# EAGLE design IO-Board-2 (EAGLE 7.4.0)

## Sheet 1 of 2: Verbinder
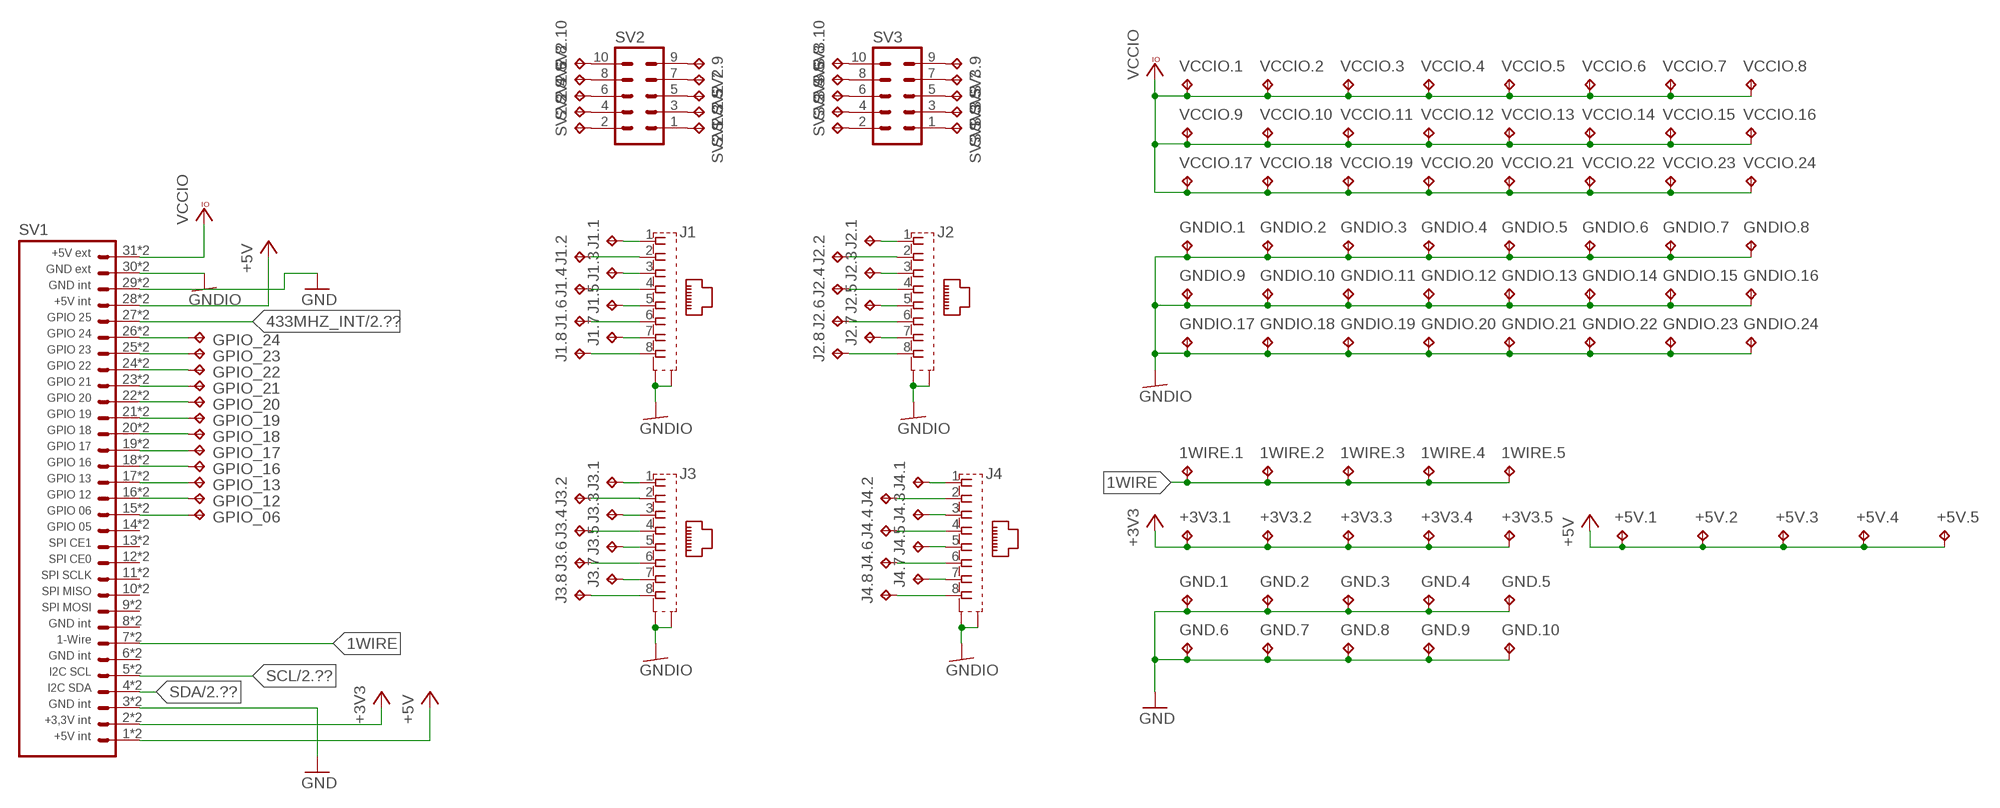
[diagram p0: schematic, sheet 1]

### Parts
1WIRE.1  TPPAD1-13  [P1-13]
1WIRE.2  TPPAD1-13  [P1-13]
1WIRE.3  TPPAD1-13  [P1-13]
1WIRE.4  TPPAD1-13  [P1-13]
1WIRE.5  TPPAD1-13  [P1-13]
+3V3.1  TPPAD1-13  [P1-13]
+3V3.2  TPPAD1-13  [P1-13]
+3V3.3  TPPAD1-13  [P1-13]
+3V3.4  TPPAD1-13  [P1-13]
+3V3.5  TPPAD1-13  [P1-13]
+5V.1  TPPAD1-13  [P1-13]
+5V.2  TPPAD1-13  [P1-13]
+5V.3  TPPAD1-13  [P1-13]
+5V.4  TPPAD1-13  [P1-13]
+5V.5  TPPAD1-13  [P1-13]
GND.1  TPPAD1-13  [P1-13]
GND.2  TPPAD1-13  [P1-13]
GND.3  TPPAD1-13  [P1-13]
GND.4  TPPAD1-13  [P1-13]
GND.5  TPPAD1-13  [P1-13]
GND.6  TPPAD1-13  [P1-13]
GND.7  TPPAD1-13  [P1-13]
GND.8  TPPAD1-13  [P1-13]
GND.9  TPPAD1-13  [P1-13]
GND.10  TPPAD1-13  [P1-13]
GNDIO.1  TPPAD1-13  [P1-13]
GNDIO.2  TPPAD1-13  [P1-13]
GNDIO.3  TPPAD1-13  [P1-13]
GNDIO.4  TPPAD1-13  [P1-13]
GNDIO.5  TPPAD1-13  [P1-13]
GNDIO.6  TPPAD1-13  [P1-13]
GNDIO.7  TPPAD1-13  [P1-13]
GNDIO.8  TPPAD1-13  [P1-13]
GNDIO.9  TPPAD1-13  [P1-13]
GNDIO.10  TPPAD1-13  [P1-13]
GNDIO.11  TPPAD1-13  [P1-13]
GNDIO.12  TPPAD1-13  [P1-13]
GNDIO.13  TPPAD1-13  [P1-13]
GNDIO.14  TPPAD1-13  [P1-13]
GNDIO.15  TPPAD1-13  [P1-13]
GNDIO.16  TPPAD1-13  [P1-13]
GNDIO.17  TPPAD1-13  [P1-13]
GNDIO.18  TPPAD1-13  [P1-13]
GNDIO.19  TPPAD1-13  [P1-13]
GNDIO.20  TPPAD1-13  [P1-13]
GNDIO.21  TPPAD1-13  [P1-13]
GNDIO.22  TPPAD1-13  [P1-13]
GNDIO.23  TPPAD1-13  [P1-13]
GNDIO.24  TPPAD1-13  [P1-13]
GPIO_06  TPPAD1-13  [P1-13]
GPIO_12  TPPAD1-13  [P1-13]
GPIO_13  TPPAD1-13  [P1-13]
GPIO_16  TPPAD1-13  [P1-13]
GPIO_17  TPPAD1-13  [P1-13]
GPIO_18  TPPAD1-13  [P1-13]
GPIO_19  TPPAD1-13  [P1-13]
GPIO_20  TPPAD1-13  [P1-13]
GPIO_21  TPPAD1-13  [P1-13]
GPIO_22  TPPAD1-13  [P1-13]
GPIO_23  TPPAD1-13  [P1-13]
GPIO_24  TPPAD1-13  [P1-13]
J1  555141-1  [555153-1]
J1.1  TPPAD1-13  [P1-13]
J1.2  TPPAD1-13  [P1-13]
J1.3  TPPAD1-13  [P1-13]
J1.4  TPPAD1-13  [P1-13]
J1.5  TPPAD1-13  [P1-13]
J1.6  TPPAD1-13  [P1-13]
J1.7  TPPAD1-13  [P1-13]
J1.8  TPPAD1-13  [P1-13]
J2  555141-1  [555153-1]
J2.1  TPPAD1-13  [P1-13]
J2.2  TPPAD1-13  [P1-13]
J2.3  TPPAD1-13  [P1-13]
J2.4  TPPAD1-13  [P1-13]
J2.5  TPPAD1-13  [P1-13]
J2.6  TPPAD1-13  [P1-13]
J2.7  TPPAD1-13  [P1-13]
J2.8  TPPAD1-13  [P1-13]
J3  555141-1  [555153-1]
J3.1  TPPAD1-13  [P1-13]
J3.2  TPPAD1-13  [P1-13]
J3.3  TPPAD1-13  [P1-13]
J3.4  TPPAD1-13  [P1-13]
J3.5  TPPAD1-13  [P1-13]
J3.6  TPPAD1-13  [P1-13]
J3.7  TPPAD1-13  [P1-13]
J3.8  TPPAD1-13  [P1-13]
J4  555141-1  [555153-1]
J4.1  TPPAD1-13  [P1-13]
J4.2  TPPAD1-13  [P1-13]
J4.3  TPPAD1-13  [P1-13]
J4.4  TPPAD1-13  [P1-13]
J4.5  TPPAD1-13  [P1-13]
J4.6  TPPAD1-13  [P1-13]
J4.7  TPPAD1-13  [P1-13]
J4.8  TPPAD1-13  [P1-13]
SV1  PLATINENVERBINDER-31SMD  [PLATINENVERBINDER-31-SMD]
SV2  ML10  [ML10]
SV2.1  TPPAD1-13  [P1-13]
SV2.2  TPPAD1-13  [P1-13]
SV2.3  TPPAD1-13  [P1-13]
SV2.4  TPPAD1-13  [P1-13]
SV2.5  TPPAD1-13  [P1-13]
SV2.6  TPPAD1-13  [P1-13]
SV2.7  TPPAD1-13  [P1-13]
SV2.8  TPPAD1-13  [P1-13]
SV2.9  TPPAD1-13  [P1-13]
SV2.10  TPPAD1-13  [P1-13]
SV3  ML10  [ML10]
SV3.1  TPPAD1-13  [P1-13]
SV3.2  TPPAD1-13  [P1-13]
SV3.3  TPPAD1-13  [P1-13]
SV3.4  TPPAD1-13  [P1-13]
SV3.5  TPPAD1-13  [P1-13]
SV3.6  TPPAD1-13  [P1-13]
SV3.7  TPPAD1-13  [P1-13]
SV3.8  TPPAD1-13  [P1-13]
SV3.9  TPPAD1-13  [P1-13]
SV3.10  TPPAD1-13  [P1-13]
VCCIO.1  TPPAD1-13  [P1-13]
VCCIO.2  TPPAD1-13  [P1-13]
VCCIO.3  TPPAD1-13  [P1-13]
VCCIO.4  TPPAD1-13  [P1-13]
VCCIO.5  TPPAD1-13  [P1-13]
VCCIO.6  TPPAD1-13  [P1-13]
VCCIO.7  TPPAD1-13  [P1-13]
VCCIO.8  TPPAD1-13  [P1-13]
VCCIO.9  TPPAD1-13  [P1-13]
VCCIO.10  TPPAD1-13  [P1-13]
VCCIO.11  TPPAD1-13  [P1-13]
VCCIO.12  TPPAD1-13  [P1-13]
VCCIO.13  TPPAD1-13  [P1-13]
VCCIO.14  TPPAD1-13  [P1-13]
VCCIO.15  TPPAD1-13  [P1-13]
VCCIO.16  TPPAD1-13  [P1-13]
VCCIO.17  TPPAD1-13  [P1-13]
VCCIO.18  TPPAD1-13  [P1-13]
VCCIO.19  TPPAD1-13  [P1-13]
VCCIO.20  TPPAD1-13  [P1-13]
VCCIO.21  TPPAD1-13  [P1-13]
VCCIO.22  TPPAD1-13  [P1-13]
VCCIO.23  TPPAD1-13  [P1-13]
VCCIO.24  TPPAD1-13  [P1-13]

### Nets
1WIRE: 1WIRE.1.TP 1WIRE.2.TP 1WIRE.3.TP 1WIRE.4.TP 1WIRE.5.TP SV1.7 SV1.7T
433MHZ_INT: SV1.27 SV1.27T ; also sheet 2
+3V3: +3V3.1.TP +3V3.2.TP +3V3.3.TP +3V3.4.TP +3V3.5.TP SV1.2 SV1.2T ; also sheet 2
+5V: +5V.1.TP +5V.2.TP +5V.3.TP +5V.4.TP +5V.5.TP SV1.1 SV1.1T
+5V_2: SV1.28 SV1.28T ; supply symbol labelled +5V ; also sheet 2
GND: GND.1.TP GND.2.TP GND.3.TP GND.4.TP GND.5.TP GND.6.TP GND.7.TP GND.8.TP GND.9.TP GND.10.TP SV1.3 SV1.3T ; also sheet 2
GND_2: SV1.29 SV1.29T ; supply symbol labelled GND ; also sheet 2
GNDIO: GNDIO.1.TP GNDIO.2.TP GNDIO.3.TP GNDIO.4.TP GNDIO.5.TP GNDIO.6.TP GNDIO.7.TP GNDIO.8.TP GNDIO.9.TP GNDIO.10.TP GNDIO.11.TP GNDIO.12.TP GNDIO.13.TP GNDIO.14.TP GNDIO.15.TP GNDIO.16.TP GNDIO.17.TP GNDIO.18.TP GNDIO.19.TP GNDIO.20.TP GNDIO.21.TP GNDIO.22.TP GNDIO.23.TP GNDIO.24.TP J1.G1(S1) J1.G2(S2) J2.G1(S1) J2.G2(S2) J3.G1(S1) J3.G2(S2) J4.G1(S1) J4.G2(S2) SV1.30 SV1.30T
N$1: J4.4 J4.4.TP
N$3: J4.3 J4.3.TP
N$4: J4.2 J4.2.TP
N$5: J4.1 J4.1.TP
N$7: GPIO_24.TP SV1.26 SV1.26T
N$36: J1.1 J1.1.TP
N$37: J1.2 J1.2.TP
N$38: J1.3 J1.3.TP
N$39: J1.4 J1.4.TP
N$40: J1.5 J1.5.TP
N$41: J1.6 J1.6.TP
N$42: J1.7 J1.7.TP
N$43: J1.8 J1.8.TP
N$44: J2.1 J2.1.TP
N$45: J2.2 J2.2.TP
N$46: J2.3 J2.3.TP
N$47: J2.4 J2.4.TP
N$48: J2.5 J2.5.TP
N$49: J2.6 J2.6.TP
N$50: J2.7 J2.7.TP
N$51: J2.8 J2.8.TP
N$129: J3.1 J3.1.TP
N$130: J3.2 J3.2.TP
N$131: J3.3 J3.3.TP
N$132: J3.4 J3.4.TP
N$133: J3.5 J3.5.TP
N$134: J3.6 J3.6.TP
N$135: J3.7 J3.7.TP
N$136: J3.8 J3.8.TP
N$141: J4.5 J4.5.TP
N$142: J4.6 J4.6.TP
N$143: J4.7 J4.7.TP
N$144: J4.8 J4.8.TP
N$146: GPIO_23.TP SV1.25 SV1.25T
N$147: GPIO_22.TP SV1.24 SV1.24T
N$148: GPIO_21.TP SV1.23 SV1.23T
N$149: GPIO_20.TP SV1.22 SV1.22T
N$150: GPIO_19.TP SV1.21 SV1.21T
N$151: GPIO_18.TP SV1.20 SV1.20T
N$152: GPIO_17.TP SV1.19 SV1.19T
N$153: GPIO_16.TP SV1.18 SV1.18T
N$154: GPIO_13.TP SV1.17 SV1.17T
N$155: GPIO_12.TP SV1.16 SV1.16T
N$156: GPIO_06.TP SV1.15 SV1.15T
N$157: SV2.1 SV2.1.TP
N$158: SV2.2 SV2.2.TP
N$159: SV2.3 SV2.3.TP
N$160: SV2.4 SV2.4.TP
N$161: SV2.5 SV2.5.TP
N$162: SV2.6 SV2.6.TP
N$163: SV2.7 SV2.7.TP
N$164: SV2.8 SV2.8.TP
N$165: SV2.9 SV2.9.TP
N$166: SV2.10 SV2.10.TP
N$167: SV3.1 SV3.1.TP
N$168: SV3.2 SV3.2.TP
N$169: SV3.3 SV3.3.TP
N$170: SV3.4 SV3.4.TP
N$171: SV3.5 SV3.5.TP
N$172: SV3.6 SV3.6.TP
N$173: SV3.7 SV3.7.TP
N$174: SV3.8 SV3.8.TP
N$175: SV3.9 SV3.9.TP
N$176: SV3.10 SV3.10.TP
SCL: SV1.5 SV1.5T ; also sheet 2
SDA: SV1.4 SV1.4T ; also sheet 2
VCCIO: SV1.31 SV1.31T VCCIO.1.TP VCCIO.2.TP VCCIO.3.TP VCCIO.4.TP VCCIO.5.TP VCCIO.6.TP VCCIO.7.TP VCCIO.8.TP VCCIO.9.TP VCCIO.10.TP VCCIO.11.TP VCCIO.12.TP VCCIO.13.TP VCCIO.14.TP VCCIO.15.TP VCCIO.16.TP VCCIO.17.TP VCCIO.18.TP VCCIO.19.TP VCCIO.20.TP VCCIO.21.TP VCCIO.22.TP VCCIO.23.TP VCCIO.24.TP
Unconnected: SV1.6 SV1.6T SV1.8 SV1.8T SV1.9 SV1.9T SV1.10 SV1.10T SV1.11 SV1.11T SV1.12 SV1.12T SV1.13 SV1.13T SV1.14 SV1.14T

## Sheet 2 of 2: 433MHz Funk
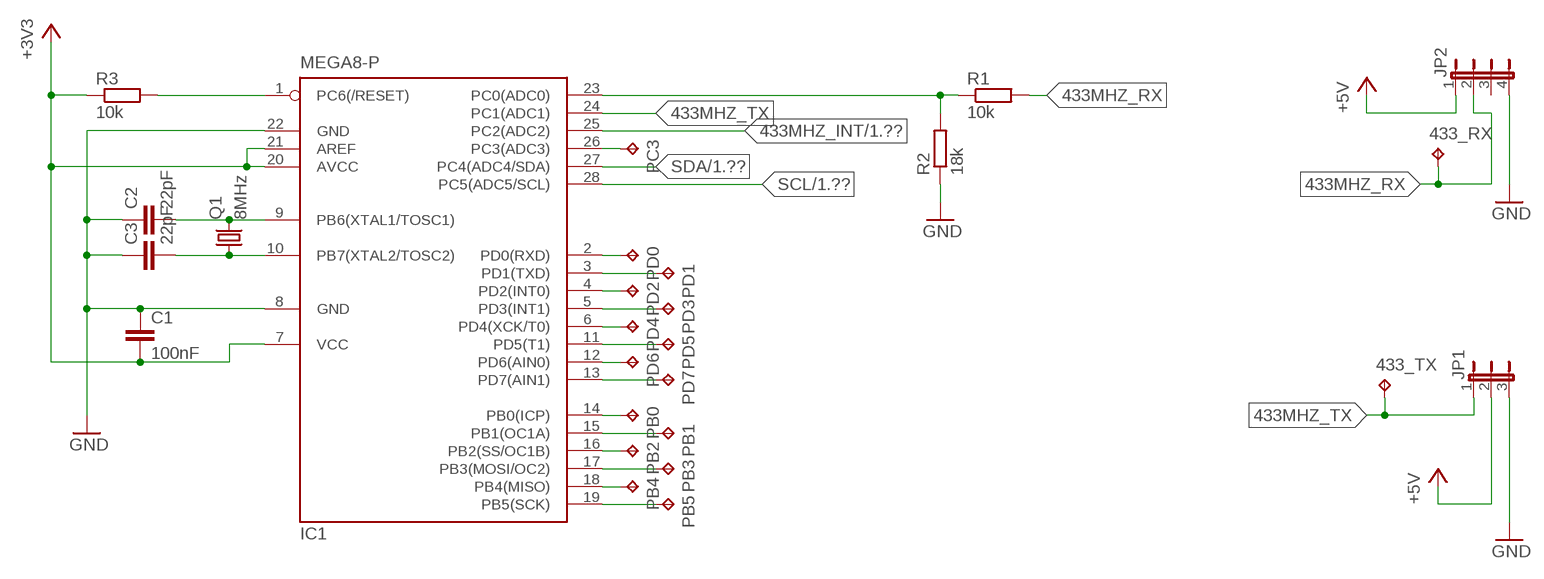
[diagram p1: schematic, sheet 2]

### Parts
433_RX  TPPAD1-13  [P1-13]
433_TX  TPPAD1-13  [P1-13]
C1  100nF  C-EU025-025X050  [C025-025X050]
C2  22pF  C-EU025-025X050  [C025-025X050]
C3  22pF  C-EU025-025X050  [C025-025X050]
IC1  MEGA8-P  [DIL28-3]
JP1  JP2E  [JP2]
JP2  JP4E  [JP4]
PB0  TPPAD1-13  [P1-13]
PB1  TPPAD1-13  [P1-13]
PB2  TPPAD1-13  [P1-13]
PB3  TPPAD1-13  [P1-13]
PB4  TPPAD1-13  [P1-13]
PB5  TPPAD1-13  [P1-13]
PC3  TPPAD1-13  [P1-13]
PD0  TPPAD1-13  [P1-13]
PD1  TPPAD1-13  [P1-13]
PD2  TPPAD1-13  [P1-13]
PD3  TPPAD1-13  [P1-13]
PD4  TPPAD1-13  [P1-13]
PD5  TPPAD1-13  [P1-13]
PD6  TPPAD1-13  [P1-13]
PD7  TPPAD1-13  [P1-13]
Q1  8MHz  CRYSTALHC49U-V  [HC49U-V]
R1  10k  R-EU_0204/5  [0204/5]
R2  18k  R-EU_0204/5  [0204/5]
R3  10k  R-EU_0204/2V  [0204V]

### Nets
433MHZ_INT: IC1.25(PC2(ADC2)) ; also sheet 1
433MHZ_RX: 433_RX.TP JP2.2 R1.2
433MHZ_TX: 433_TX.TP IC1.24(PC1(ADC1)) JP1.1
+3V3: C1.2 IC1.7(VCC) IC1.20(AVCC) IC1.21(AREF) R3.1 ; also sheet 1
+5V_2: JP1.2 JP2.1 ; supply symbol labelled +5V ; also sheet 1
GND: C1.1 C2.1 C3.1 IC1.8(GND) IC1.22(GND) ; also sheet 1
GND_2: JP1.3 JP2.4 R2.1 ; supply symbol labelled GND ; also sheet 1
N$2: IC1.23(PC0(ADC0)) R1.1 R2.2
N$6: IC1.1(PC6(/RESET)) R3.2
N$8: IC1.26(PC3(ADC3)) PC3.TP
N$9: IC1.2(PD0(RXD)) PD0.TP
N$10: IC1.3(PD1(TXD)) PD1.TP
N$11: IC1.4(PD2(INT0)) PD2.TP
N$12: IC1.5(PD3(INT1)) PD3.TP
N$13: IC1.6(PD4(XCK/T0)) PD4.TP
N$14: IC1.11(PD5(T1)) PD5.TP
N$15: IC1.12(PD6(AIN0)) PD6.TP
N$16: IC1.13(PD7(AIN1)) PD7.TP
N$17: IC1.14(PB0(ICP)) PB0.TP
N$18: IC1.15(PB1(OC1A)) PB1.TP
N$19: IC1.16(PB2(SS/OC1B)) PB2.TP
N$20: IC1.17(PB3(MOSI/OC2)) PB3.TP
N$21: IC1.18(PB4(MISO)) PB4.TP
N$22: IC1.19(PB5(SCK)) PB5.TP
N$23: C3.2 IC1.10(PB7(XTAL2/TOSC2)) Q1.1
N$24: C2.2 IC1.9(PB6(XTAL1/TOSC1)) Q1.2
SCL: IC1.28(PC5(ADC5/SCL)) ; also sheet 1
SDA: IC1.27(PC4(ADC4/SDA)) ; also sheet 1
Unconnected: JP2.3

## Library data of the parts
1WIRE.1-1WIRE.5 433_RX 433_TX +3V3.1-+3V3.5 +5V.1-+5V.5 GND.1-GND.10 GNDIO.1-GNDIO.24 GPIO_06 GPIO_12 GPIO_13 GPIO_16-GPIO_24 J1.1-J1.8 J2.1-J2.8 J3.1-J3.8 J4.1-J4.8 PB0 PB1-PB5 PC3 PD0 PD1-PD7 SV2.1-SV2.10 SV3.1-SV3.10 VCCIO.1-VCCIO.24 = testpad:TP: Test pad
C1-C3 = rcl:C-EU: CAPACITOR, European symbol
IC1 = atmel:MEGA8-P: MICROCONTROLLER 8 Kbytes FLASH, 1 kbytes SRAM, 512 bytes EEPROM, USART, 4-channel 10 bit ADC, 2-channel 8 bit ADC Pin compatible with Atmega48, ATMega88, ATMega168 Source: avr.lbr; OC_FARNELL: unknown; OC_NEWARK: unknown
J1-J4 = con-amp:555141-1: AMP connector
JP1 = jumper:JP2E: JUMPER
JP2 = jumper:JP4E: JUMPER
Q1 = crystal:CRYSTAL: CRYSTAL; OC_FARNELL: 1666969; OC_NEWARK: unknown
R1-R3 = rcl:R-EU_: RESISTOR, European symbol
SV1 = homepi:PLATINENVERBINDER-31: 31-poliger Steckverbinder
SV2 SV3 = con-harting-ml:ML10: HARTING; OC_FARNELL: unknown; OC_NEWARK: unknown

## Board
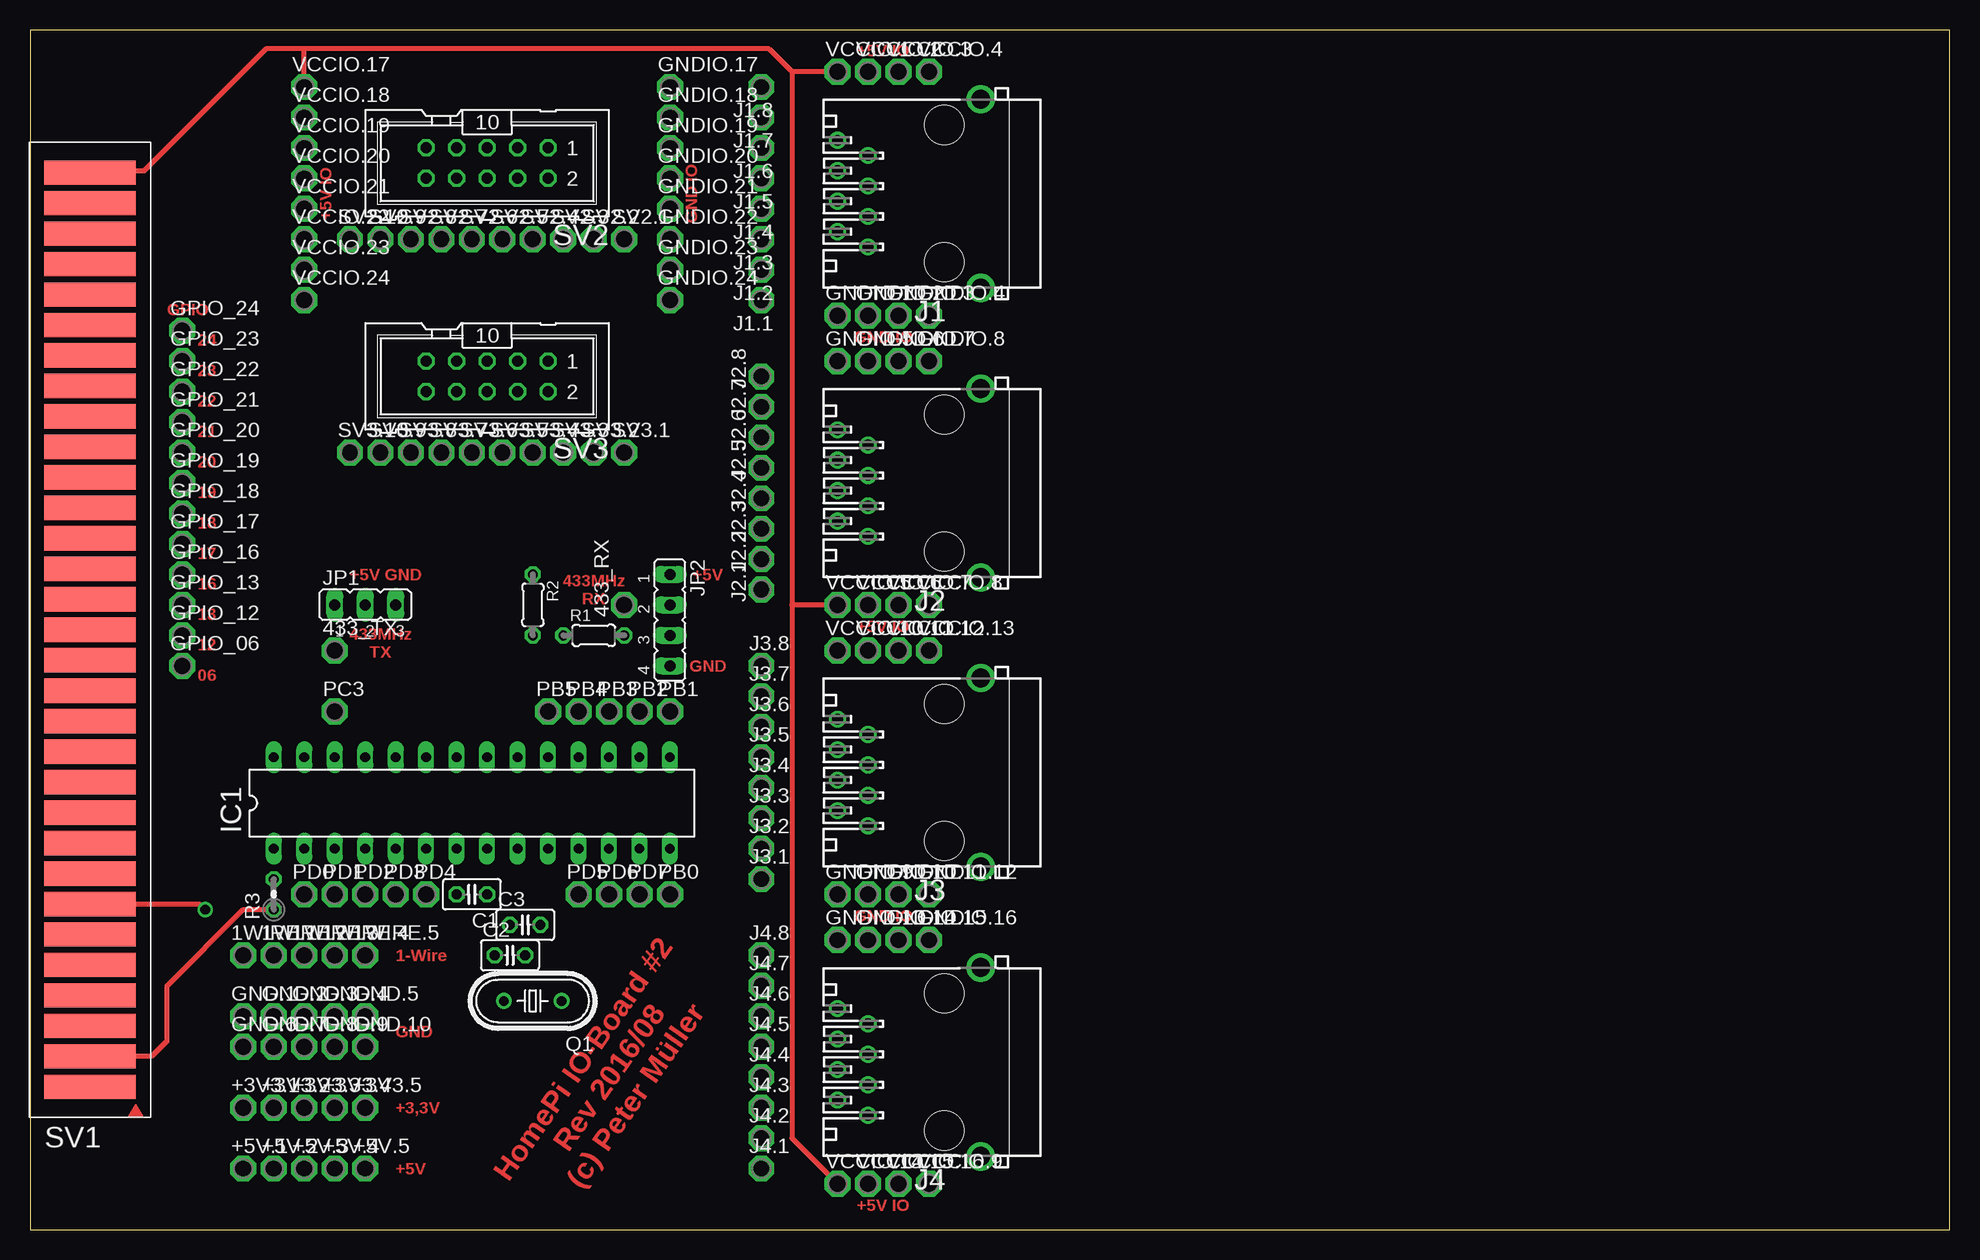
[diagram p2: board, top side]
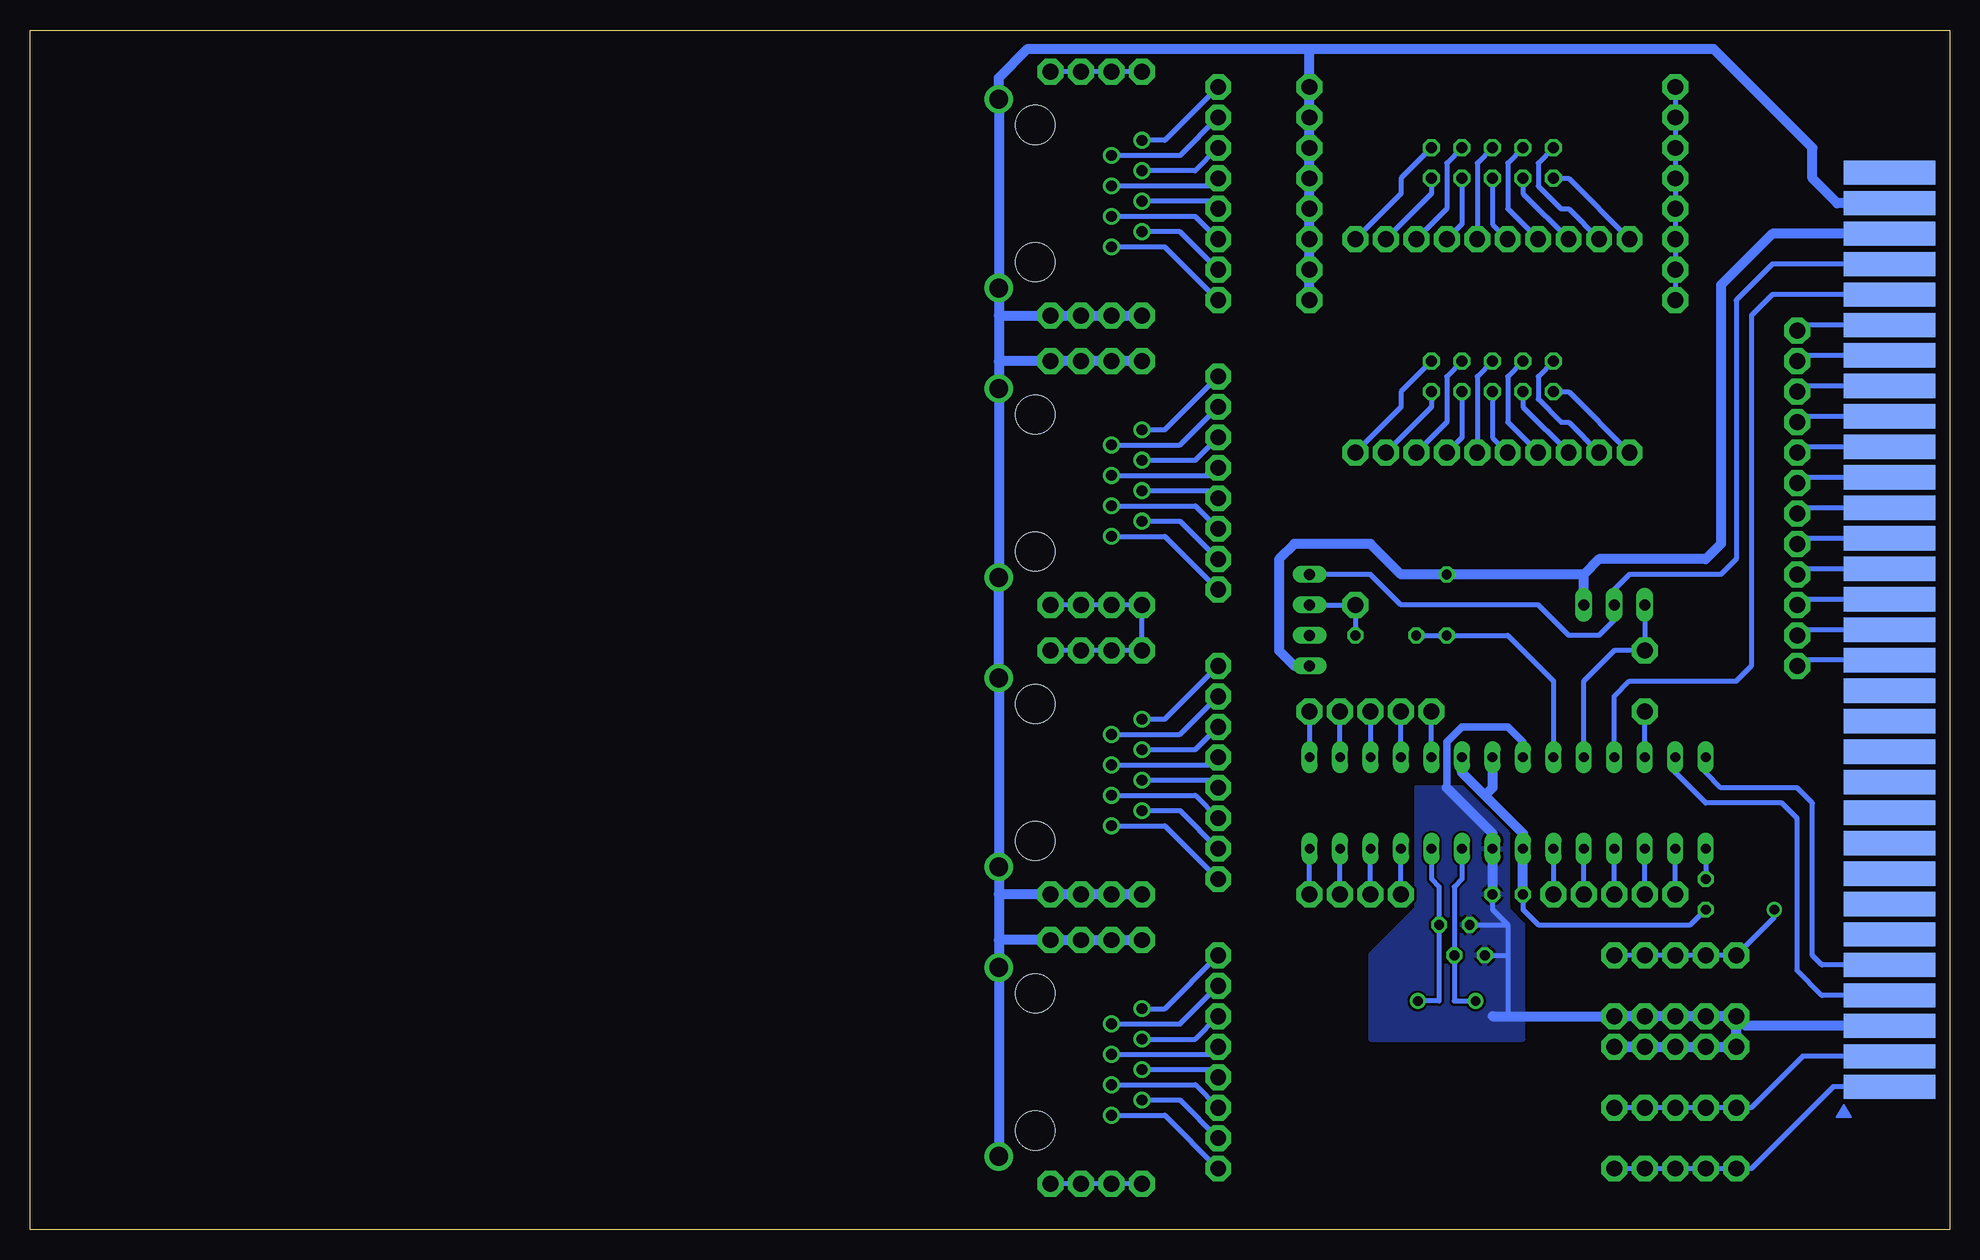
[diagram p3: board, bottom side, seen from below]

Size 160 x 100 mm. Coordinates in mm from the lower left corner, seen from the top.
Outline: 0,0 160,0 160,100 0,100 0,0
Copper layers (1*16): Top 0.035mm / dielectric 1.5mm / Bottom 0.035mm
Design rules "default": minimum track width 10mil, minimum drill 24mil, track to track 8mil, track to pad 8mil, pad to pad 8mil, via to via 8mil, smd to smd 8mil, copper to edge 40mil, drill to drill 8mil, minimum pad ring 10mil, minimum via ring 8mil, stop-mask expansion 4mil, vias tented up to drill 0mil, thermal gap 10mil

### Footprints (pad centres in the part's own frame; a part is rotated, then mirrored left to right if it is on the bottom)
P1-13 = drill 1.321 pad 2.159 octagon: TP 0,0
C025-025X050 = drill 0.813 octagon: 1 -1.27,0; 2 1.27,0
DIL28-3 = drill 0.813 long: 1 -16.51,-3.81; 2 -13.97,-3.81; 3 -11.43,-3.81; 4 -8.89,-3.81; 5 -6.35,-3.81; 6 -3.81,-3.81; 7 -1.27,-3.81; 8 1.27,-3.81; 9 3.81,-3.81; 10 6.35,-3.81; 11 8.89,-3.81; 12 11.43,-3.81; 13 13.97,-3.81; 14 16.51,-3.81; 15 16.51,3.81; 16 13.97,3.81; 17 11.43,3.81; 18 8.89,3.81; 19 6.35,3.81; 20 3.81,3.81; 21 1.27,3.81; 22 -1.27,3.81; 23 -3.81,3.81; 24 -6.35,3.81; 25 -8.89,3.81; 26 -11.43,3.81; 27 -13.97,3.81; 28 -16.51,3.81
555153-1 = drill 0.889: 1 -4.445,6.35; 2 -3.175,8.89; 3 -1.905,6.35; 4 -0.635,8.89; 5 0.635,6.35; 6 1.905,8.89; 7 3.175,6.35; 8 4.445,8.89 | drill 1.575 pad 2.184: G1 -7.874,-3.048; G2 7.874,-3.048 | hole 3.251: -5.715,0; 5.715,0
JP2 = drill 0.914 long: 1 -2.54,0; 2 0,0; 3 2.54,0
JP4 = drill 0.914 long: 1 -3.81,0; 2 -1.27,0; 3 1.27,0; 4 3.81,0
HC49U-V = drill 0.813: 1 -2.413,0; 2 2.413,0
0204/5 = drill 0.813 octagon: 1 -2.54,0; 2 2.54,0
0204V = drill 0.813 octagon: 1 -1.27,0; 2 1.27,0
PLATINENVERBINDER-31-SMD = smd 7.62 x 2.032 bottom: 1 0,-38.1; 2 0,-35.56; 3 0,-33.02; 4 0,-30.48; 5 0,-27.94; 6 0,-25.4; 7 0,-22.86; 8 0,-20.32; 9 0,-17.78; 10 0,-15.24; 11 0,-12.7; 12 0,-10.16; 13 0,-7.62; 14 0,-5.08; 15 0,-2.54; 16 0,0; 17 0,2.54; 18 0,5.08; 19 0,7.62; 20 0,10.16; 21 0,12.7; 22 0,15.24; 23 0,17.78; 24 0,20.32; 25 0,22.86; 26 0,25.4; 27 0,27.94; 28 0,30.48; 29 0,33.02; 30 0,35.56; 31 0,38.1 | smd 7.62 x 2.032: 1T 0,-38.1; 2T 0,-35.56; 3T 0,-33.02; 4T 0,-30.48; 5T 0,-27.94; 6T 0,-25.4; 7T 0,-22.86; 8T 0,-20.32; 9T 0,-17.78; 10T 0,-15.24; 11T 0,-12.7; 12T 0,-10.16; 13T 0,-7.62; 14T 0,-5.08; 15T 0,-2.54; 16T 0,0; 17T 0,2.54; 18T 0,5.08; 19T 0,7.62; 20T 0,10.16; 21T 0,12.7; 22T 0,15.24; 23T 0,17.78; 24T 0,20.32; 25T 0,22.86; 26T 0,25.4; 27T 0,27.94; 28T 0,30.48; 29T 0,33.02; 30T 0,35.56; 31T 0,38.1
ML10 = drill 0.914 octagon: 1 -5.08,-1.27; 2 -5.08,1.27; 3 -2.54,-1.27; 4 -2.54,1.27; 5 0,-1.27; 6 0,1.27; 7 2.54,-1.27; 8 2.54,1.27; 9 5.08,-1.27; 10 5.08,1.27

### Placement (x,y rotation side)
1WIRE.1  17.78,22.86 0 top
1WIRE.2  20.32,22.86 0 top
1WIRE.3  22.86,22.86 0 top
1WIRE.4  25.4,22.86 0 top
1WIRE.5  27.94,22.86 0 top
433_RX  49.53,52.07 90 top
433_TX  25.4,48.26 0 top
+3V3.1  17.78,10.16 0 top
+3V3.2  20.32,10.16 0 top
+3V3.3  22.86,10.16 0 top
+3V3.4  25.4,10.16 0 top
+3V3.5  27.94,10.16 0 top
+5V.1  17.78,5.08 0 top
+5V.2  20.32,5.08 0 top
+5V.3  22.86,5.08 0 top
+5V.4  25.4,5.08 0 top
+5V.5  27.94,5.08 0 top
C1  36.83,27.94 180 top
C2  40.01,22.86 0 top
C3  41.27,25.4 0 top
GND.1  17.78,17.78 0 top
GND.2  20.32,17.78 0 top
GND.3  22.86,17.78 0 top
GND.4  25.4,17.78 0 top
GND.5  27.94,17.78 0 top
GND.6  17.78,15.24 0 top
GND.7  20.32,15.24 0 top
GND.8  22.86,15.24 0 top
GND.9  25.4,15.24 0 top
GND.10  27.94,15.24 0 top
GNDIO.1  67.31,76.2 0 top
GNDIO.2  69.85,76.2 0 top
GNDIO.3  72.39,76.2 0 top
GNDIO.4  74.93,76.2 0 top
GNDIO.5  67.31,72.39 0 top
GNDIO.6  69.85,72.39 0 top
GNDIO.7  72.39,72.39 0 top
GNDIO.8  74.93,72.39 0 top
GNDIO.9  67.31,27.94 0 top
GNDIO.10  69.85,27.94 0 top
GNDIO.11  72.39,27.94 0 top
GNDIO.12  74.93,27.94 0 top
GNDIO.13  67.31,24.13 0 top
GNDIO.14  69.85,24.13 0 top
GNDIO.15  72.39,24.13 0 top
GNDIO.16  74.93,24.13 0 top
GNDIO.17  53.34,95.25 0 top
GNDIO.18  53.34,92.71 0 top
GNDIO.19  53.34,90.17 0 top
GNDIO.20  53.34,87.63 0 top
GNDIO.21  53.34,85.09 0 top
GNDIO.22  53.34,82.55 0 top
GNDIO.23  53.34,80.01 0 top
GNDIO.24  53.34,77.47 0 top
GPIO_06  12.7,46.99 0 top
GPIO_12  12.7,49.53 0 top
GPIO_13  12.7,52.07 0 top
GPIO_16  12.7,54.61 0 top
GPIO_17  12.7,57.15 0 top
GPIO_18  12.7,59.69 0 top
GPIO_19  12.7,62.23 0 top
GPIO_20  12.7,64.77 0 top
GPIO_21  12.7,67.31 0 top
GPIO_22  12.7,69.85 0 top
GPIO_23  12.7,72.39 0 top
GPIO_24  12.7,74.93 0 top
IC1  36.83,35.56 0 top
J1  76.2,86.36 90 top
J1.1  60.96,77.47 180 top
J1.2  60.96,80.01 180 top
J1.3  60.96,82.55 180 top
J1.4  60.96,85.09 180 top
J1.5  60.96,87.63 180 top
J1.6  60.96,90.17 180 top
J1.7  60.96,92.71 180 top
J1.8  60.96,95.25 180 top
J2  76.2,62.23 90 top
J2.1  60.96,53.34 90 top
J2.2  60.96,55.88 90 top
J2.3  60.96,58.42 90 top
J2.4  60.96,60.96 90 top
J2.5  60.96,63.5 90 top
J2.6  60.96,66.04 90 top
J2.7  60.96,68.58 90 top
J2.8  60.96,71.12 90 top
J3  76.2,38.1 90 top
J3.1  60.96,29.21 0 top
J3.2  60.96,31.75 0 top
J3.3  60.96,34.29 0 top
J3.4  60.96,36.83 0 top
J3.5  60.96,39.37 0 top
J3.6  60.96,41.91 0 top
J3.7  60.96,44.45 0 top
J3.8  60.96,46.99 0 top
J4  76.2,13.97 90 top
J4.1  60.96,5.08 0 top
J4.2  60.96,7.62 0 top
J4.3  60.96,10.16 0 top
J4.4  60.96,12.7 0 top
J4.5  60.96,15.24 0 top
J4.6  60.96,17.78 0 top
J4.7  60.96,20.32 0 top
J4.8  60.96,22.86 0 top
JP1  27.94,52.07 0 top
JP2  53.34,50.8 270 top
PB0  53.34,27.94 0 top
PB1  53.34,43.18 0 top
PB2  50.8,43.18 0 top
PB3  48.26,43.18 0 top
PB4  45.72,43.18 0 top
PB5  43.18,43.18 0 top
PC3  25.4,43.18 0 top
PD0  22.86,27.94 0 top
PD1  25.4,27.94 0 top
PD2  27.94,27.94 0 top
PD3  30.48,27.94 0 top
PD4  33.02,27.94 0 top
PD5  45.72,27.94 0 top
PD6  48.26,27.94 0 top
PD7  50.8,27.94 0 top
Q1  41.91,19.05 180 top
R1  46.99,49.53 0 top
R2  41.91,52.07 270 top
R3  20.32,27.94 90 top
SV1  5,50 0 top
SV2  38.1,88.9 180 top
SV2.1  49.53,82.55 0 top
SV2.2  46.99,82.55 0 top
SV2.3  44.45,82.55 0 top
SV2.4  41.91,82.55 0 top
SV2.5  39.37,82.55 0 top
SV2.6  36.83,82.55 0 top
SV2.7  34.29,82.55 0 top
SV2.8  31.75,82.55 0 top
SV2.9  29.21,82.55 0 top
SV2.10  26.67,82.55 0 top
SV3  38.1,71.12 180 top
SV3.1  49.53,64.77 0 top
SV3.2  46.99,64.77 0 top
SV3.3  44.45,64.77 0 top
SV3.4  41.91,64.77 0 top
SV3.5  39.37,64.77 0 top
SV3.6  36.83,64.77 0 top
SV3.7  34.29,64.77 0 top
SV3.8  31.75,64.77 0 top
SV3.9  29.21,64.77 0 top
SV3.10  26.67,64.77 0 top
VCCIO.1  67.31,96.52 0 top
VCCIO.2  69.85,96.52 0 top
VCCIO.3  72.39,96.52 0 top
VCCIO.4  74.93,96.52 0 top
VCCIO.5  67.31,52.07 0 top
VCCIO.6  69.85,52.07 0 top
VCCIO.7  72.39,52.07 0 top
VCCIO.8  74.93,52.07 0 top
VCCIO.9  74.93,3.81 0 top
VCCIO.10  67.31,48.26 0 top
VCCIO.11  69.85,48.26 0 top
VCCIO.12  72.39,48.26 0 top
VCCIO.13  74.93,48.26 0 top
VCCIO.14  67.31,3.81 0 top
VCCIO.15  69.85,3.81 0 top
VCCIO.16  72.39,3.81 0 top
VCCIO.17  22.86,95.25 0 top
VCCIO.18  22.86,92.71 0 top
VCCIO.19  22.86,90.17 0 top
VCCIO.20  22.86,87.63 0 top
VCCIO.21  22.86,85.09 0 top
VCCIO.22  22.86,82.55 0 top
VCCIO.23  22.86,80.01 0 top
VCCIO.24  22.86,77.47 0 top

### Tracks (layer width: path | path; a pad name or v marks a point on that pad's centre or on a via)
1WIRE  (via drill 0.8 pad 1.27)
  Top 0.406: SV1.7T 14.13,27.14 v14.61,26.67
  Bottom 0.406: 1WIRE.5.TP 1WIRE.4.TP 1WIRE.3.TP 1WIRE.2.TP 1WIRE.1.TP 14.61,26.04 v14.61,26.67
433MHZ_INT
  Bottom 0.406: SV1.27 14.77,77.94 16.51,76.2 16.51,46.99 17.78,45.72 26.67,45.72 27.94,44.45 IC1.25
433MHZ_RX
  Bottom 0.406: R1.2 433_RX.TP JP2.2
433MHZ_TX
  Bottom 0.406: JP1.1 433_TX.TP 27.94,48.26 30.48,45.72 IC1.24
+3V3
  Top 0.406: SV1.2T 10.16,14.44 11.43,15.71 11.43,20.32 17.78,26.67 R3.1
  Bottom 0.406: +3V3.5.TP +3V3.4.TP +3V3.3.TP +3V3.2.TP +3V3.1.TP 16.51,10.16 12.23,14.44 SV1.2T | C1.2 35.56,26.67 34.29,25.4 21.59,25.4 R3.1
  Bottom 0.813: C1.2 IC1.7 35.56,33.02 38.73,36.2 | 38.73,36.2 40.64,38.1 IC1.20 | IC1.21 38.1,36.83 38.73,36.2
+5V
  Bottom 0.406: +5V.5.TP +5V.4.TP +5V.3.TP +5V.2.TP +5V.1.TP 16.51,5.08 9.69,11.9 SV1.1
+5V_2
  Bottom 0.406: SV1.28 14.77,80.48 17.78,77.47 17.78,55.88 19.05,54.61 26.67,54.61 27.94,53.34 JP1.2 27.94,50.8 29.21,49.53 31.75,49.53 34.29,52.07 45.72,52.07 48.26,54.61 JP2.1
GND
  Bottom 0.406: C1.1 38.1,26.67 36.83,25.4 | 36.83,25.4 36.83,22.86 | 36.83,22.86 36.83,17.78 | C2.1 36.83,22.86 | C3.1 36.83,25.4
  Bottom 0.61: 41.91,36.83 41.91,40.64 40.64,41.91 36.83,41.91 35.56,40.64 IC1.22
  Bottom 0.813: GND.1.TP GND.2.TP GND.3.TP GND.4.TP GND.5.TP 36.83,17.78 38.1,17.78 | GND.6.TP GND.1.TP | GND.6.TP GND.7.TP GND.8.TP GND.10.TP GND.9.TP | 17.31,15.71 GND.6.TP | C1.1 IC1.8 38.1,33.02 41.91,36.83 | SV1.3T 16.98,16.98 GND.1.TP
  pour Bottom: 35.56,15.88 35.56,25.4 36.83,26.67 36.83,33.02 40.64,36.83 44.45,36.83 44.45,26.67 48.26,22.86 48.26,15.88
GND_2
  Bottom 0.813: SV1.29T 14.77,83.02 19.05,78.74 19.05,57.15 20.32,55.88 29.21,55.88 30.48,54.61 | 30.48,54.61 R2.1 45.72,54.61 48.26,57.15 54.61,57.15 55.88,55.88 55.88,48.26 54.61,46.99 JP2.4 | JP1.3 30.48,54.61
GNDIO
  Bottom 0.813: 79.25,76.2 J1.G1 J1.G2 79.25,96.01 76.83,98.42 53.34,98.42 | 79.25,76.2 79.25,72.39 | 79.25,72.39 J2.G2 J2.G1 J3.G2 J3.G1 79.25,27.94 | 53.34,98.42 19.68,98.42 11.43,90.17 11.43,87.63 9.36,85.56 SV1.30T | 79.25,27.94 79.25,24.13 | 79.25,24.13 J4.G2 J4.G1 79.38,5.97 | 79.25,76.2 GNDIO.4.TP GNDIO.3.TP GNDIO.2.TP GNDIO.1.TP | GNDIO.5.TP GNDIO.6.TP GNDIO.7.TP GNDIO.8.TP 79.25,72.39 | 79.25,27.94 GNDIO.12.TP GNDIO.11.TP GNDIO.10.TP GNDIO.9.TP | 79.25,24.13 GNDIO.16.TP GNDIO.15.TP GNDIO.14.TP GNDIO.13.TP | 53.34,98.42 GNDIO.17.TP GNDIO.18.TP GNDIO.19.TP GNDIO.20.TP GNDIO.21.TP GNDIO.22.TP GNDIO.23.TP GNDIO.24.TP
N$1
  Bottom 0.406: J4.4 61.59,13.34 J4.4.TP
N$2
  Bottom 0.406: IC1.23 33.02,45.72 36.83,49.53 R2.2 R1.1
N$3
  Bottom 0.406: J4.3 62.87,12.06 J4.3.TP
N$4
  Bottom 0.406: J4.2 64.14,10.79 J4.2.TP
N$5
  Bottom 0.406: J4.1 65.41,9.53 J4.1.TP
N$6
  Bottom 0.406: IC1.1 R3.2
N$7
  Bottom 0.406: SV1.26T 12.23,75.4 GPIO_24.TP
N$8
  Bottom 0.406: IC1.26 PC3.TP
N$9
  Bottom 0.406: PD0.TP IC1.2
N$10
  Bottom 0.406: PD1.TP IC1.3
N$11
  Bottom 0.406: PD2.TP IC1.4
N$12
  Bottom 0.406: PD3.TP IC1.5
N$13
  Bottom 0.406: IC1.6 PD4.TP
N$14
  Bottom 0.406: PD5.TP IC1.11
N$15
  Bottom 0.406: PD6.TP IC1.12
N$16
  Bottom 0.406: PD7.TP IC1.13
N$17
  Bottom 0.406: PB0.TP IC1.14
N$18
  Bottom 0.406: PB1.TP IC1.15
N$19
  Bottom 0.406: IC1.16 PB2.TP
N$20
  Bottom 0.406: PB3.TP IC1.17
N$21
  Bottom 0.406: IC1.18 PB4.TP
N$22
  Bottom 0.406: IC1.19 PB5.TP
N$23
  Bottom 0.406: IC1.10 43.18,29.21 42.55,28.57 C3.2 42.55,19.05 Q1.1
N$24
  Bottom 0.406: IC1.9 40.64,29.21 41.27,28.57 C2.2 41.27,19.05 Q1.2
N$36
  Bottom 0.406: J1.1.TP 65.41,81.92 J1.1
N$37
  Bottom 0.406: J1.2.TP 64.14,83.19 J1.2
N$38
  Bottom 0.406: J1.3 62.87,84.45 J1.3.TP
N$39
  Bottom 0.406: J1.4 61.59,85.72 J1.4.TP
N$40
  Bottom 0.406: J1.5 61.59,87 J1.5.TP
N$41
  Bottom 0.406: J1.6 62.87,88.27 J1.6.TP
N$42
  Bottom 0.406: J1.7.TP 64.14,89.53 J1.7
N$43
  Bottom 0.406: J1.8.TP 65.41,90.81 J1.8
N$44
  Bottom 0.406: J2.1 65.41,57.78 J2.1.TP
N$45
  Bottom 0.406: J2.2 64.14,59.05 J2.2.TP
N$46
  Bottom 0.406: J2.3 62.87,60.33 J2.3.TP
N$47
  Bottom 0.406: J2.4 61.59,61.59 J2.4.TP
N$48
  Bottom 0.406: J2.5 61.59,62.87 J2.5.TP
N$49
  Bottom 0.406: J2.6 62.87,64.14 J2.6.TP
N$50
  Bottom 0.406: J2.7 64.14,65.41 J2.7.TP
N$51
  Bottom 0.406: J2.8 65.41,66.67 J2.8.TP
N$129
  Bottom 0.406: J3.1 65.41,33.66 J3.1.TP
N$130
  Bottom 0.406: J3.2 64.14,34.92 J3.2.TP
N$131
  Bottom 0.406: J3.3 62.87,36.2 J3.3.TP
N$132
  Bottom 0.406: J3.4 61.59,37.47 J3.4.TP
N$133
  Bottom 0.406: J3.5 61.59,38.73 J3.5.TP
N$134
  Bottom 0.406: J3.6 62.87,40.01 J3.6.TP
N$135
  Bottom 0.406: J3.7 64.14,41.27 J3.7.TP
N$136
  Bottom 0.406: J3.8 65.41,42.55 J3.8.TP
N$141
  Bottom 0.406: J4.5 61.59,14.61 J4.5.TP
N$142
  Bottom 0.406: J4.6 62.87,15.88 J4.6.TP
N$143
  Bottom 0.406: J4.7 64.14,17.14 J4.7.TP
N$144
  Bottom 0.406: J4.8 65.41,18.41 J4.8.TP
N$146
  Bottom 0.406: SV1.25T 12.23,72.86 GPIO_23.TP
N$147
  Bottom 0.406: SV1.24 12.23,70.32 GPIO_22.TP
N$148
  Bottom 0.406: SV1.23T 12.23,67.78 GPIO_21.TP
N$149
  Bottom 0.406: SV1.22 12.23,65.24 GPIO_20.TP
N$150
  Bottom 0.406: SV1.21 12.23,62.7 GPIO_19.TP
N$151
  Bottom 0.406: SV1.20T 12.23,60.16 GPIO_18.TP
N$152
  Bottom 0.406: SV1.19 12.23,57.62 GPIO_17.TP
N$153
  Bottom 0.406: SV1.18 12.23,55.08 GPIO_16.TP
N$154
  Bottom 0.406: SV1.17 12.23,52.54 GPIO_13.TP
N$155
  Bottom 0.406: SV1.16 12.23,50 GPIO_12.TP
N$156
  Bottom 0.406: SV1.15 12.23,47.46 GPIO_06.TP
N$157
  Bottom 0.406: SV2.1 45.72,87.63 45.72,86.36 SV2.1.TP
N$158
  Bottom 0.406: SV2.2 43.18,86.36 SV2.2.TP
N$159
  Bottom 0.406: SV2.3 41.91,88.9 41.91,85.09 SV2.3.TP
N$160
  Bottom 0.406: SV2.4 40.64,83.82 SV2.4.TP
N$161
  Bottom 0.406: SV2.5 39.37,88.9 SV2.5.TP
N$162
  Bottom 0.406: SV2.6 38.1,83.82 SV2.6.TP
N$163
  Bottom 0.406: SV2.7 36.83,88.9 36.83,85.09 SV2.7.TP
N$164
  Bottom 0.406: SV2.8 35.56,86.36 SV2.8.TP
N$165
  Bottom 0.406: SV2.9 34.29,88.9 34.29,87 32.38,85.09 31.75,85.09 SV2.9.TP
N$166
  Bottom 0.406: SV2.10 31.75,87.63 SV2.10.TP
N$167
  Bottom 0.406: SV3.1 45.72,69.85 45.72,68.58 SV3.1.TP
N$168
  Bottom 0.406: SV3.2 43.18,68.58 SV3.2.TP
N$169
  Bottom 0.406: SV3.3 41.91,71.12 41.91,67.31 SV3.3.TP
N$170
  Bottom 0.406: SV3.4 40.64,66.04 SV3.4.TP
N$171
  Bottom 0.406: SV3.5 39.37,71.12 SV3.5.TP
N$172
  Bottom 0.406: SV3.6 38.1,66.04 SV3.6.TP
N$173
  Bottom 0.406: SV3.7 36.83,71.12 36.83,67.31 SV3.7.TP
N$174
  Bottom 0.406: SV3.8 35.56,68.58 SV3.8.TP
N$175
  Bottom 0.406: SV3.9 34.29,71.12 34.29,69.22 32.38,67.31 31.75,67.31 SV3.9.TP
N$176
  Bottom 0.406: SV3.10 31.75,69.85 SV3.10.TP
SCL
  Bottom 0.406: SV1.5T 10.63,22.06 11.43,22.86 11.43,35.56 12.7,36.83 19.05,36.83 20.32,38.1 IC1.28
SDA
  Bottom 0.406: SV1.4T 10.63,19.52 12.7,21.59 12.7,34.29 13.97,35.56 20.32,35.56 22.86,38.1 IC1.27
VCCIO
  Top 0.406: SV1.31T 5.17,88.27 9.53,88.27 19.68,98.42 22.86,98.42 | 22.86,98.42 61.59,98.42 63.5,96.52 | 63.5,96.52 63.5,52.07 | VCCIO.1.TP 63.5,96.52 | VCCIO.5.TP 63.5,52.07 | VCCIO.17.TP 22.86,98.42 | 63.5,52.07 63.5,7.62 VCCIO.14.TP
  Bottom 0.406: VCCIO.17.TP VCCIO.18.TP VCCIO.19.TP VCCIO.20.TP VCCIO.21.TP VCCIO.22.TP VCCIO.23.TP VCCIO.24.TP | VCCIO.1.TP VCCIO.2.TP VCCIO.3.TP VCCIO.4.TP | VCCIO.8.TP VCCIO.7.TP VCCIO.6.TP VCCIO.5.TP VCCIO.10.TP VCCIO.11.TP VCCIO.12.TP VCCIO.13.TP | VCCIO.14.TP VCCIO.15.TP VCCIO.16.TP VCCIO.9.TP

### Text on the board
Top: +5V IO | +5V IO | GND IO | GPIO | GND IO | 24 | 23 | 22 | 21 | 20 | 19 | 18 | 17 | +5V | GND | +5V | 16 | 433MHz / RX | 13 | +5V IO | 12 | 433MHz / TX | GND | 06 | GND IO | 1-Wire | GND | HomePi IO-Board #2 / Rev 2016/08 / (c) Peter Müller | +3,3V | +5V | +5V IO